# EAGLE schematic Rapide10 (EAGLE 9.3.0)
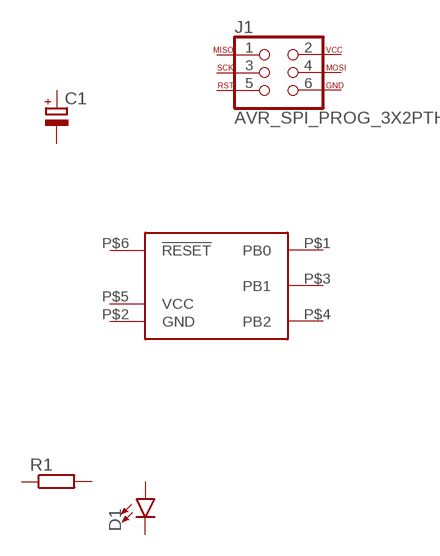
[diagram p0: schematic, sheet 1]

## Parts
C1  CPOL-EUE2-5  [E2-5]
D1  LED3MM  [LED_3MM]
J1  AVR_SPI_PROG_3X2PTH  [2X3]
R1  R-EU_0204/2V  [0204V]
U$1  ATTINY10  [SOT23]
Unconnected: C1.+ C1.- D1.A D1.K(C) J1.1 J1.2 J1.3 J1.4 J1.5 J1.6 R1.1 R1.2 U$1.P$1(PB0) U$1.P$2(GND) U$1.P$3(PB1) U$1.P$4(PB2) U$1.P$5(VCC) U$1.P$6(!RESET)

## Library data of the parts
C1 = resistor:CPOL-EU: POLARIZED CAPACITOR, European symbol
D1 = SparkFun-LED:LED: LED (Generic) Standard schematic elements and footprints for 5mm, 3mm, 1206, and 0603 sized LEDs. Generic LEDs with no color specified.; PROD_ID: DIO-08794
J1 = SparkFun-Connectors:AVR_SPI_PROG_3X2: AVR ISP 6 Pin This is the reduced ISP connector for AVR programming. Common on Arduino. This footprint will take up less PCB space and can be used with a 10-pin to 6-pin adapter such as SKU: BOB-08508 **Special note about "TEST_POINT" package. The stop mask is on the top side, so if you want your programming test points to be on the bottom of your board, make sure to place this package on the bottom side of the board. This also ensure that the orientation to program from the bottom side will be correct. SparkFun Products: SparkFun ISP Pogo Adapter <https://www.sparkfun.com/products/11591> - NS Tiny AVR Programmer <https://www.sparkfun.com/products/11801> -PTH
R1 = resistor:R-EU_: RESISTOR, European symbol
U$1 = kalshagar:ATTINY10